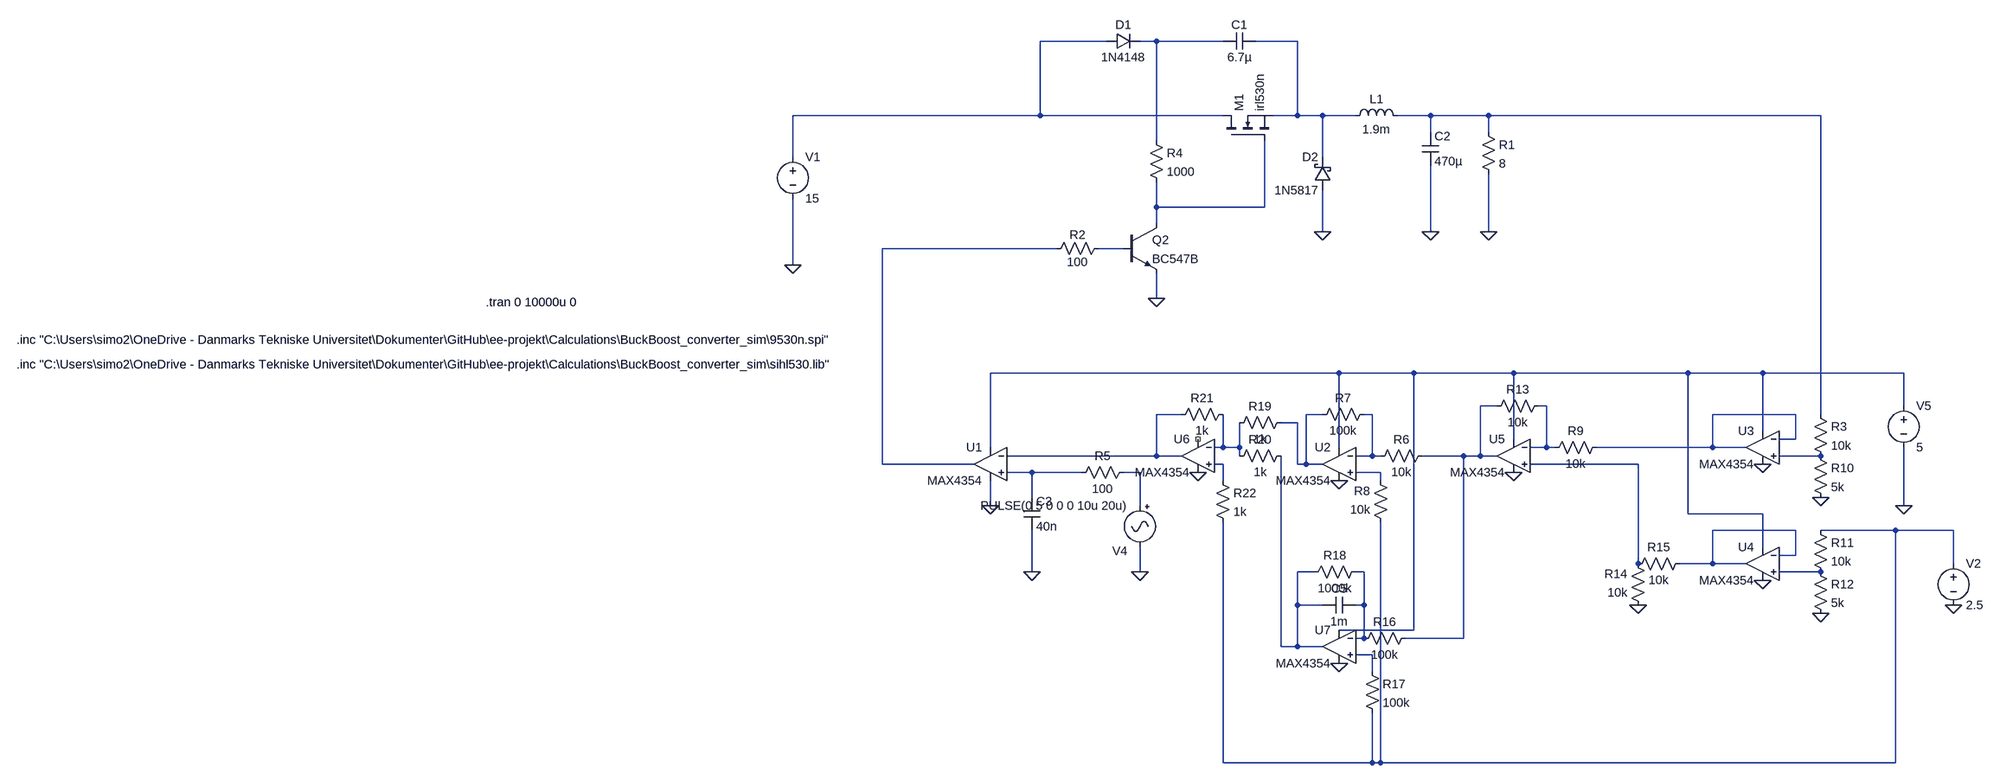
[diagram p0: schematic BuckBoost_P-Channel-v2switch_+analogkontrol.asc]
BuckBoost_P-Channel-v2switch_+analogkontrol.asc, the LTspice schematic file:
Version 4
SHEET 1 1808 1524
WIRE 112 16 -16 16
WIRE 208 16 176 16
WIRE 336 16 208 16
WIRE 480 16 400 16
WIRE -16 160 -16 16
WIRE -16 160 -496 160
WIRE 336 160 -16 160
WIRE 480 160 480 16
WIRE 480 160 432 160
WIRE 528 160 480 160
WIRE 592 160 528 160
WIRE 736 160 672 160
WIRE 848 160 736 160
WIRE 1488 160 848 160
WIRE 736 192 736 160
WIRE 848 192 848 160
WIRE 208 208 208 16
WIRE -496 240 -496 160
WIRE 528 240 528 160
WIRE 208 336 208 288
WIRE 416 336 416 208
WIRE 416 336 208 336
WIRE 208 368 208 336
WIRE 528 384 528 304
WIRE 736 384 736 256
WIRE 848 384 848 272
WIRE 16 416 -320 416
WIRE 144 416 96 416
WIRE -496 448 -496 320
WIRE 208 512 208 464
WIRE 560 656 -112 656
WIRE 704 656 560 656
WIRE 896 656 704 656
WIRE 1232 656 896 656
WIRE 1376 656 1232 656
WIRE 1648 656 1376 656
WIRE 864 720 832 720
WIRE 960 720 944 720
WIRE 1648 720 1648 656
WIRE 256 736 208 736
WIRE 528 736 496 736
WIRE 624 736 608 736
WIRE 1440 736 1280 736
WIRE 1488 736 1488 160
WIRE 480 752 448 752
WIRE 1376 768 1376 656
WIRE 896 784 896 656
WIRE 1440 784 1440 736
WIRE 1440 784 1408 784
WIRE -112 800 -112 656
WIRE 336 800 336 736
WIRE 336 800 320 800
WIRE 368 800 368 752
WIRE 368 800 336 800
WIRE 560 800 560 656
WIRE 960 800 960 720
WIRE 960 800 928 800
WIRE 976 800 960 800
WIRE 1280 800 1280 736
WIRE 1280 800 1056 800
WIRE 1344 800 1280 800
WIRE 208 816 208 736
WIRE 208 816 -80 816
WIRE 256 816 208 816
WIRE 368 816 368 800
WIRE 624 816 624 736
WIRE 624 816 592 816
WIRE 640 816 624 816
WIRE 800 816 720 816
WIRE 832 816 832 720
WIRE 832 816 800 816
WIRE 864 816 832 816
WIRE 1488 816 1408 816
WIRE -320 832 -320 416
WIRE -144 832 -320 832
WIRE 336 832 320 832
WIRE 480 832 480 752
WIRE 496 832 496 736
WIRE 496 832 480 832
WIRE 528 832 496 832
WIRE 1136 832 928 832
WIRE -32 848 -80 848
WIRE 64 848 -32 848
WIRE 176 848 144 848
WIRE 640 848 592 848
WIRE 336 864 336 832
WIRE 640 864 640 848
WIRE -32 896 -32 848
WIRE -112 912 -112 864
WIRE 176 912 176 848
WIRE 1648 912 1648 800
WIRE 1232 928 1232 656
WIRE 1376 928 1232 928
WIRE 1440 960 1280 960
WIRE 1632 960 1488 960
WIRE 1744 960 1632 960
WIRE 1376 992 1376 928
WIRE 1440 1008 1440 960
WIRE 1440 1008 1408 1008
WIRE 1136 1024 1136 832
WIRE 1280 1024 1280 960
WIRE 1280 1024 1216 1024
WIRE 1344 1024 1280 1024
WIRE 1744 1024 1744 960
WIRE -32 1040 -32 960
WIRE 176 1040 176 992
WIRE 512 1040 480 1040
WIRE 608 1040 592 1040
WIRE 1488 1040 1408 1040
WIRE 480 1104 480 1040
WIRE 528 1104 480 1104
WIRE 608 1104 608 1040
WIRE 608 1104 592 1104
WIRE 704 1152 704 656
WIRE 704 1152 560 1152
WIRE 608 1168 608 1104
WIRE 608 1168 592 1168
WIRE 800 1168 800 816
WIRE 800 1168 688 1168
WIRE 448 1184 448 816
WIRE 480 1184 480 1104
WIRE 480 1184 448 1184
WIRE 528 1184 480 1184
WIRE 624 1200 592 1200
WIRE 624 1232 624 1200
WIRE 336 1408 336 944
WIRE 624 1408 624 1312
WIRE 624 1408 336 1408
WIRE 640 1408 640 944
WIRE 640 1408 624 1408
WIRE 1632 1408 1632 960
WIRE 1632 1408 640 1408
FLAG -496 448 0
FLAG 848 384 0
FLAG 208 512 0
FLAG 736 384 0
FLAG 176 1040 0
FLAG -32 1040 0
FLAG 1648 912 0
FLAG -112 912 0
FLAG 560 864 0
FLAG 1376 832 0
FLAG 1488 896 0
FLAG 1376 1056 0
FLAG 1488 1120 0
FLAG 528 384 0
FLAG 560 1216 0
FLAG 896 848 0
FLAG 1136 1104 0
FLAG 288 848 0
FLAG 1744 1104 0
SYMBOL voltage -496 224 R0
WINDOW 123 0 0 Left 0
WINDOW 39 0 0 Left 0
SYMATTR InstName V1
SYMATTR Value 15
SYMBOL res 832 176 R0
SYMATTR InstName R1
SYMATTR Value 8
SYMBOL res 112 400 R90
WINDOW 0 5 56 VBottom 2
WINDOW 3 27 56 VTop 2
SYMATTR InstName R2
SYMATTR Value 100
SYMBOL nmos 336 208 R270
SYMATTR InstName M1
SYMATTR Value irl530n
SYMATTR Prefix X
SYMBOL cap 400 0 R90
WINDOW 0 0 32 VBottom 2
WINDOW 3 32 32 VTop 2
SYMATTR InstName C1
SYMATTR Value 6.7µ
SYMBOL diode 112 32 R270
WINDOW 0 32 32 VTop 2
WINDOW 3 0 32 VBottom 2
SYMATTR InstName D1
SYMATTR Value 1N4148
SYMBOL npn 144 368 R0
SYMATTR InstName Q2
SYMATTR Value BC547B
SYMBOL res 192 192 R0
SYMATTR InstName R4
SYMATTR Value 1000
SYMBOL ind 576 176 R270
WINDOW 0 32 56 VTop 2
WINDOW 3 5 56 VBottom 2
SYMATTR InstName L1
SYMATTR Value 1.9m
SYMBOL cap 720 192 R0
SYMATTR InstName C2
SYMATTR Value 470µ
SYMBOL OpAmps\\MAX4354 -112 768 M0
SYMATTR InstName U1
SYMBOL Misc\\signal 176 896 M0
WINDOW 0 24 104 Left 2
WINDOW 3 24 16 Left 2
WINDOW 123 0 0 Left 0
WINDOW 39 0 0 Left 0
SYMATTR InstName V4
SYMATTR Value PULSE(0 5 0 0 0 10u 20u)
SYMBOL res 160 832 R90
WINDOW 0 0 56 VBottom 2
WINDOW 3 32 56 VTop 2
SYMATTR InstName R5
SYMATTR Value 100
SYMBOL cap -48 896 R0
SYMATTR InstName C3
SYMATTR Value 40n
SYMBOL voltage 1648 704 R0
WINDOW 123 0 0 Left 0
WINDOW 39 0 0 Left 0
SYMATTR InstName V5
SYMATTR Value 5
SYMBOL OpAmps\\MAX4354 560 768 M0
SYMATTR InstName U2
SYMBOL res 736 800 R90
WINDOW 0 0 56 VBottom 2
WINDOW 3 32 56 VTop 2
SYMATTR InstName R6
SYMATTR Value 10k
SYMBOL res 624 720 R90
WINDOW 0 0 56 VBottom 2
WINDOW 3 32 56 VTop 2
SYMATTR InstName R7
SYMATTR Value 100k
SYMBOL OpAmps\\MAX4354 1376 736 M0
SYMATTR InstName U3
SYMBOL res 1472 720 R0
SYMATTR InstName R3
SYMATTR Value 10k
SYMBOL res 1472 800 R0
SYMATTR InstName R10
SYMATTR Value 5k
SYMBOL OpAmps\\MAX4354 1376 960 M0
SYMATTR InstName U4
SYMBOL res 1472 944 R0
SYMATTR InstName R11
SYMATTR Value 10k
SYMBOL res 1472 1024 R0
SYMATTR InstName R12
SYMATTR Value 5k
SYMBOL res 656 960 R180
WINDOW 0 36 76 Left 2
WINDOW 3 36 40 Left 2
SYMATTR InstName R8
SYMATTR Value 10k
SYMBOL schottky 544 304 R180
WINDOW 0 24 64 Left 2
WINDOW 3 24 0 Left 2
SYMATTR InstName D2
SYMATTR Value 1N5817
SYMATTR Description Diode
SYMATTR Type diode
SYMBOL OpAmps\\MAX4354 560 1120 M0
SYMATTR InstName U7
SYMBOL res 704 1152 R90
WINDOW 0 0 56 VBottom 2
WINDOW 3 32 56 VTop 2
SYMATTR InstName R16
SYMATTR Value 100k
SYMBOL res 608 1216 R0
SYMATTR InstName R17
SYMATTR Value 100k
SYMBOL cap 592 1088 R90
WINDOW 0 0 32 VBottom 2
WINDOW 3 32 32 VTop 2
SYMATTR InstName C5
SYMATTR Value 1m
SYMBOL res 608 1024 R90
WINDOW 0 0 56 VBottom 2
WINDOW 3 32 56 VTop 2
SYMATTR InstName R18
SYMATTR Value 1000k
SYMBOL OpAmps\\MAX4354 896 752 M0
SYMATTR InstName U5
SYMBOL res 1072 784 R90
WINDOW 0 0 56 VBottom 2
WINDOW 3 32 56 VTop 2
SYMATTR InstName R9
SYMATTR Value 10k
SYMBOL res 960 704 R90
WINDOW 0 0 56 VBottom 2
WINDOW 3 32 56 VTop 2
SYMATTR InstName R13
SYMATTR Value 10k
SYMBOL res 1152 1120 R180
WINDOW 0 36 76 Left 2
WINDOW 3 36 40 Left 2
SYMATTR InstName R14
SYMATTR Value 10k
SYMBOL res 1232 1008 R90
WINDOW 0 0 56 VBottom 2
WINDOW 3 32 56 VTop 2
SYMATTR InstName R15
SYMATTR Value 10k
SYMBOL OpAmps\\MAX4354 288 752 M0
SYMATTR InstName U6
SYMBOL res 464 736 R90
WINDOW 0 0 56 VBottom 2
WINDOW 3 32 56 VTop 2
SYMATTR InstName R19
SYMATTR Value 1k
SYMBOL res 464 800 R90
WINDOW 0 0 56 VBottom 2
WINDOW 3 32 56 VTop 2
SYMATTR InstName R20
SYMATTR Value 1k
SYMBOL res 352 720 R90
WINDOW 0 0 56 VBottom 2
WINDOW 3 32 56 VTop 2
SYMATTR InstName R21
SYMATTR Value 1k
SYMBOL res 320 848 R0
SYMATTR InstName R22
SYMATTR Value 1k
SYMBOL voltage 1744 1008 R0
WINDOW 123 0 0 Left 0
WINDOW 39 0 0 Left 0
SYMATTR InstName V2
SYMATTR Value 2.5
TEXT -1992 592 Left 2 !.inc "C:\\Users\\simo2\\OneDrive - Danmarks Tekniske Universitet\\Dokumenter\\GitHub\\ee-projekt\\Calculations\\BuckBoost_converter_sim\\9530n.spi"
TEXT -1088 520 Left 2 !.tran 0 10000u 0
TEXT -1992 640 Left 2 !.inc "C:\\Users\\simo2\\OneDrive - Danmarks Tekniske Universitet\\Dokumenter\\GitHub\\ee-projekt\\Calculations\\BuckBoost_converter_sim\\sihl530.lib"

The netlist it stands for:
* BuckBoost_P-Channel-v2switch_+analogkontrol.asc
V1 N001 0 15
R1 N004 0 8
R2 N007 N006 100
XM1 N001 N005 N003 irl530n  ; pins D G S
C1 N003 N002 6.7µ
D1 N001 N002 1N4148
Q2 N005 N007 0 0 BC547B
R4 N002 N005 1000
L1 N003 N004 1.9m
C2 N004 0 470µ
XU1 N019 N011 N008 0 N006 MAX4354  ; pins In+ In- V+ V- OUT
V4 N020 0 PULSE(0 5 0 0 0 10u 20u)
R5 N020 N019 100
C3 N019 0 40n
V5 N008 0 5
XU2 N021 N013 N008 0 N012 MAX4354  ; pins In+ In- V+ V- OUT
R6 N009 N013 10k
R7 N013 N012 100k
XU3 N016 N014 N008 0 N014 MAX4354  ; pins In+ In- V+ V- OUT
R3 N004 N016 10k
R10 N016 0 5k
XU4 N026 N022 N008 0 N022 MAX4354  ; pins In+ In- V+ V- OUT
R11 N023 N026 10k
R12 N026 0 5k
R8 N023 N021 10k
D2 0 N003 1N5817
XU7 N027 N025 N008 0 N024 MAX4354  ; pins In+ In- V+ V- OUT
R16 N009 N025 100k
R17 N027 N023 100k
C5 N025 N024 1m
R18 N025 N024 1000k
XU5 N018 N010 N008 0 N009 MAX4354  ; pins In+ In- V+ V- OUT
R9 N014 N010 10k
R13 N010 N009 10k
R14 0 N018 10k
R15 N022 N018 10k
XU6 N017 N015 NC_01 0 N011 MAX4354  ; pins In+ In- V+ V- OUT
R19 N012 N015 1k
R20 N024 N015 1k
R21 N015 N011 1k
R22 N017 N023 1k
V2 N023 0 2.5
.model D D
.lib standard.dio
.model NPN NPN
.model PNP PNP
.lib standard.bjt
.inc "C:\Users\simo2\OneDrive - Danmarks Tekniske Universitet\Dokumenter\GitHub\ee-projekt\Calculations\BuckBoost_converter_sim\9530n.spi"
.tran 0 10000u 0
.inc "C:\Users\simo2\OneDrive - Danmarks Tekniske Universitet\Dokumenter\GitHub\ee-projekt\Calculations\BuckBoost_converter_sim\sihl530.lib"
.lib MAX4354.lib
.backanno
.end